# Altium schematic sheet Rail_Splitter.SchDoc
size A4; Organization: Altium Limited; Address1: L3, 12a Rodborough Rd; Address2: Frenchs Forest; Address3: NSW; Address4: Australia 2086
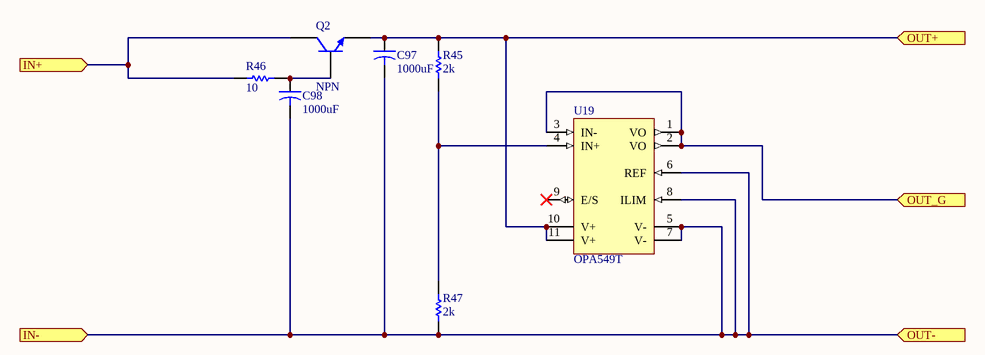
[diagram p0: Rail_Splitter.SchDoc]

## Parts
C97  1000uF  [UVR1V102MHD1TO]
C98  1000uF  [UVR1V102MHD1TO]
Q2  NPN  [TO-220-3]
R45  2k  [STD_0805_R]
R46  10  [2512_SMD]
R47  2k  [STD_0805_R]
U19  OPA549T  [KV0011A]

## Ports
IN+ (in), IN- (in), OUT+ (in), OUT- (in), OUT_G (in)

## Nets
IN+: Q2.1(C) R46.1 ; port IN+
IN-: C97.2 C98.2 R47.1 U19.5(V-) U19.6(REF) U19.7(V-) U19.8(ILIM) ; port IN-, port OUT-
OUT+: C97.1 Q2.3(E) R45.2 U19.10(V+) U19.11(V+) ; port OUT+
OUT_G: U19.1(VO) U19.2(VO) U19.3(IN-) ; port OUT_G
NetC98_1: C98.1 Q2.2(B) R46.2
NetR45_1: R45.1 R47.2 U19.4(IN+)

Not connected (* = marked no-connect by the designer): U19 9(E/S)*

## Notes on the sheet
- Title
- Date:
- RE:
- Arturo di Girolamo
- Size:
- A3
- A

## Library data of the parts
C97 C98 = UVR1V102MHD1TO: Capacitor, 100uF NICHICON; MFGPN: UVR1V102MHD1TO
Q2 = NPN: NPN Bipolar Transistor; Published: 8-Jun-2000; LatestRevisionDate: 17-Jul-2002; LatestRevisionNote: Re-released for DXP Platform.; PackageReference: TO-226-AA; Publisher: Altium Limited; PackageDescription: TO, Flat Index; 3 In-Line, Axial Leads; Body Dia. 4.8mm; Leads 0.55 x 0.51 mm (max); Code_JEDEC: TO-226-AA
R45 R47 = RC0805FR-0717K8L: 17.8k; Value: 17.8k; MFGPN: RC0805FR-0717K8L
R46 = RNCF0805DTE10R0: 10 ohm 0805; Value: 10; MFGPN: RNCF0805DTE10R0
U19 = CMP-0272-03689-4: High-Voltage, High-Current Operational Amplifier, Excellent Output Swing, 8 to 60 V, -40 to 125 degC, 11-pin FM (KV), Green (RoHS & no Sb/Br); Manufacturer: Texas Instruments; Number of Channels: 1; CMRR(Min)(dB): 80; Rating: Military; Iq per channel(Max)(mA): 35; Total Supply Voltage(Min)(+5V is 5, +/-5V is 10): 8; Packing: TUBE; GBW(Typ)(MHz): 0.9; Total Supply Voltage(Max)(+5V is 5, +/-5V is 10): 60; Vio (25C)(Max)(mV): 5; Offset Drift(Typ)(uV/C): 20; Slew Rate(Typ)(V/us): 9; IIB(Max)(pA): 500000; Sub Family: High Output Current Amplifier (>=50mA), High Supply Voltage Amplifier (>=30V), Precision Amplifier; DatasheetVersion: SBOS093E; ComponentLink1URL: http://www.ti.com/; PartNumber: OPA549T; PackageVersion: 4202503/C, 06/2009; ComponentLink2URL: http://www.ti.com/lit/ds/symlink/opa549.pdf; Eco-Plan: Green (RoHS & no Sb/Br); Mounting Technology: Through Hole; Code_JEDEC: MO-48-AA; ComponentLink2Description: Datasheet; ComponentLink3Description: Package Specification; PackageReference: KV0011A; PackageDescription: 11-Pin Plastic Flange Mount, Body 20.015 x 4.495 mm, Pitch 1.7 mm; ComponentLink1Description: Manufacturer URL; ComponentLink3URL: http://www.ti.com/litv/pdf/mpzf003b